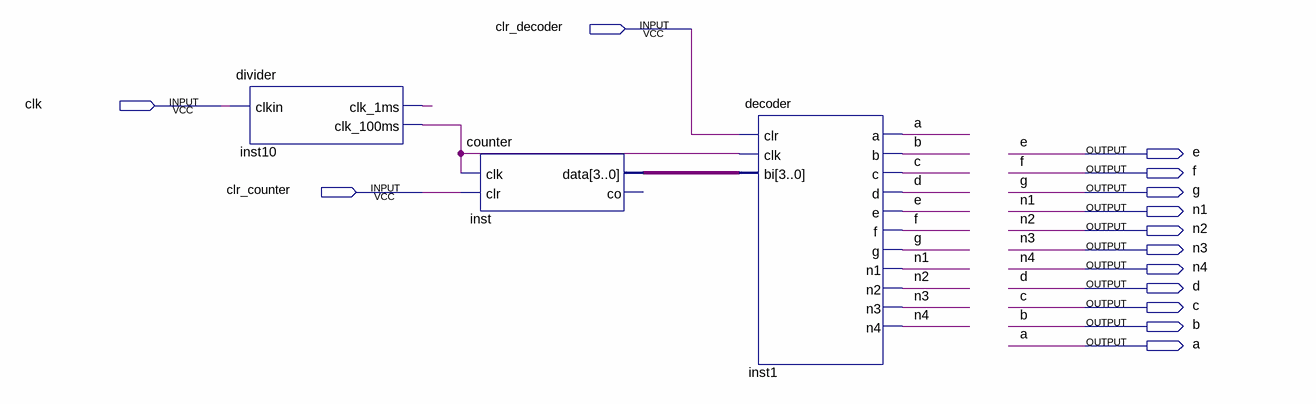
[diagram p0: schematic sheet]
// Quartus schematic serialscan.bdf as structural Verilog: 3 symbols, 14 pins
module serialscan (
  input  clr_decoder,
  input  clk,
  input  clr_counter,
  output e,
  output f,
  output g,
  output n1,
  output n2,
  output n3,
  output n4,
  output d,
  output c,
  output b,
  output a
);

  wire inst10_clk_1ms, inst10_clk_100ms;
  wire [3:0] inst_data;

  divider inst10 (.clkin(clk), .clk_1ms(inst10_clk_1ms), .clk_100ms(inst10_clk_100ms));
  counter inst (.clk(inst10_clk_100ms), .clr(clr_counter), .data(inst_data));  // open: co
  decoder inst1 (
    .clr(clr_decoder), .clk(inst10_clk_100ms), .bi(inst_data), .a(a), .b(b), .c(c), .d(d), .e(e), .f(f),
    .g(g), .n1(n1), .n2(n2), .n3(n3), .n4(n4));
endmodule
